# EAGLE schematic bluetooth_bma400 (EAGLE 9.6.2)
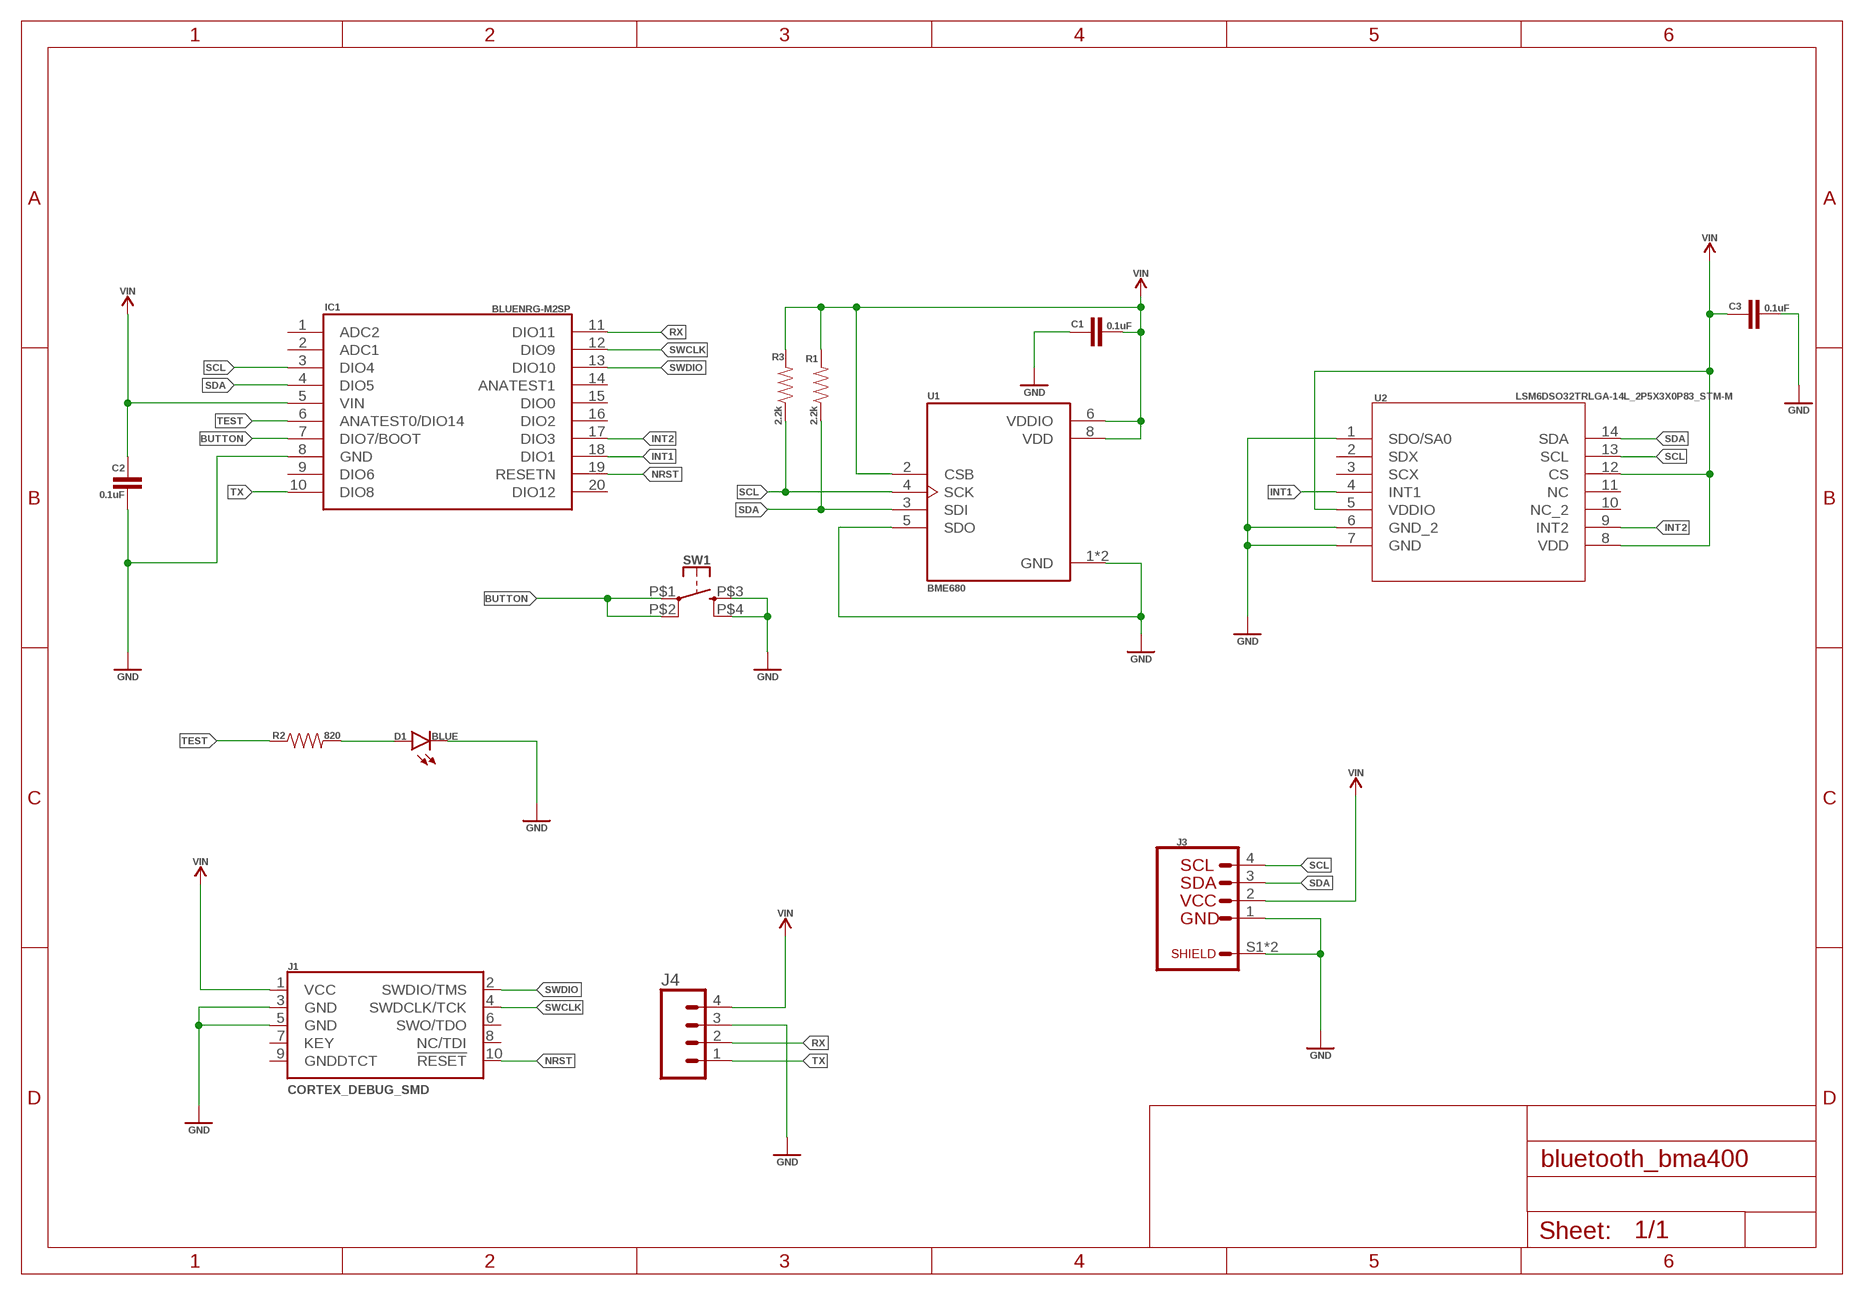
[diagram p0: schematic, sheet 1]

## Parts
C1  0.1uF  0.1UF-0603-25V-(+80/-20%)  [0603]
C2  0.1uF  0.1UF-0603-25V-(+80/-20%)  [0603]
C3  0.1uF  0.1UF-0603-25V-(+80/-20%)  [0603]
D1  BLUE  LED-BLUE0603  [LED-0603]
IC1  BLUENRG-M2SP  [BLUENRGM2SP]
J1  CORTEX_DEBUG_SMD  [SAMTECH_FTSH-105-01]
J3  QWIIC  [CONN_BM04B-SRSS-TB(LF)(SN)]
J4  CONN_04SMD  [1X04_SMD_RA_MALE]
R1  2.2k  2.2KOHM-0603-1/10W-1%  [0603]
R2  820  8.2KOHM-0603-1/10W-5%  [0603]
R3  2.2k  2.2KOHM-0603-1/10W-1%  [0603]
SW1  REVERSE_SWITCH  [REVERSE_TACTILE]
U1  BME680  [PSON80P300X300X100-8N]
U2  LSM6DSO32TRLGA-14L_2P5X3X0P83_STM-M  [LGA-14L_2P5X3X0P83_STM-M]

## Nets
BUTTON: IC1.7(DIO7/BOOT) SW1.P$1 SW1.P$2
GND: C1.1 C2.2 C3.2 D1.C IC1.8(GND) J1.3(GND) J1.5(GND) J3.1 J3.S1 J3.S2 J4.3(SDA) SW1.P$3 SW1.P$4 U1.1(GND) U1.5(SDO) U1.7(GND) U2.1(SDO/SA0) U2.6(GND_2) U2.7(GND)
INT1: IC1.18(DIO1) U2.4(INT1)
INT2: IC1.17(DIO3) U2.9(INT2)
N$1: D1.A R2.2
NRST: IC1.19(RESETN) J1.10(!RESET)
RX: IC1.11(DIO11) J4.2(SCL)
SCL: IC1.3(DIO4) J3.4 R3.1 U1.4(SCK) U2.13(SCL)
SDA: IC1.4(DIO5) J3.3 R1.1 U1.3(SDI) U2.14(SDA)
SWCLK: IC1.12(DIO9) J1.4(SWDCLK/TCK)
SWDIO: IC1.13(DIO10) J1.2(SWDIO/TMS)
TEST: IC1.6(ANATEST0/DIO14) R2.1
TX: IC1.10(DIO8) J4.1(VCC)
VIN: C1.2 C2.1 C3.1 IC1.5(VIN) J1.1(VCC) J3.2 J4.4(GND) R1.2 R3.2 U1.2(CSB) U1.6(VDDIO) U1.8(VDD) U2.5(VDDIO) U2.8(VDD) U2.12(CS)
Unconnected: IC1.1(ADC2) IC1.2(ADC1) IC1.9(DIO6) IC1.14(ANATEST1) IC1.15(DIO0) IC1.16(DIO2) IC1.20(DIO12) J1.6(SWO/TDO) J1.7(KEY) J1.8(NC/TDI) J1.9(GNDDTCT) U2.2(SDX) U2.3(SCX) U2.10(NC_2) U2.11(NC)

## Library data of the parts
C1-C3 = SparkFun-Capacitors:0.1UF: 0.1µF ceramic capacitors A capacitor is a passive two-terminal electrical component used to store electrical energy temporarily in an electric field.; PROD_ID: CAP-00810
D1 = SparkFun-LED:LED-BLUE: Blue SMD LED Used in manufacturing of various products at SparkFun Packages: 0603 - SMD 0603 package [Product Link] <http://www.digikey.com/product-detail/en/SMLE12BC7TT86/511-1589-2-ND/1641808> 1206 - SMD1206 package [Product Link] <http://www.digikey.com/product-detail/en/lite-on-inc/LTST-C150TBKT/160-1643-1-ND/573584> SparkFun Products: ESP8266 Thing-Dev Board <https://www.sparkfun.com/products/13711> RedBoard <https://www.sparkfun.com/products/12757>; PROD_ID: DIO-08575
IC1 = SamacSys_Parts:BLUENRG-M2SP: STMicroelectronics Source: Datasheet <https://www.st.com/resource/en/datasheet/bluenrg-m2.pdf>; ARROW_PART_NUMBER: BLUENRG-M2SP; ARROW_PRICE-STOCK: https://www.arrow.com/en/products/bluenrg-m2sp/stmicroelectronics; DESCRIPTION: STMicroelectronics; HEIGHT: 2.5mm; MANUFACTURER_NAME: STMicroelectronics; MANUFACTURER_PART_NUMBER: BLUENRG-M2SP; MOUSER_PART_NUMBER: 511-BLUENRG-M2SP; MOUSER_PRICE-STOCK: https://www.mouser.co.uk/ProductDetail/STMicroelectronics/BLUENRG-M2SP?qs=%252B6g0mu59x7IAMQd6TX9bOA%3D%3D
J1 = SparkFun-Connectors:CORTEX_DEBUG: Cortex Debug Connector - 10 pin Supports JTAG debug, Serial Wire debug, and Serial Wire Viewer. PTH and SMD connector options available. General Connector Information <http://infocenter.arm.com/help/topic/com.arm.doc.faqs/attached/13634/cortex_debug_connectors.pdf> Products: PTH Connector <http://www.digikey.com/product-detail/en/cnc-tech/3220-10-0100-00/1175-1627-ND/3883661> -via Digi-Key SparkFun PSoc <https://www.sparkfun.com/products/13229> SparkFun T <https://www.sparkfun.com/products/13810>
J3 = BM04B-SRSS-TB_LF__SN_:QWIIC
J4 = SparkFun-Connectors:CONN_04: Multi connection point. Often used as Generic Header-pin footprint for 0.1 inch spaced/style header connections On any of the 0.1 inch spaced packages, you can populate with these: Break Away Headers - Straight <https://www.sparkfun.com/products/116> (PRT-00116) Break Away Male Headers - Right Angle <https://www.sparkfun.com/products/553> (PRT-00553) Female Headers <https://www.sparkfun.com/products/115> (PRT-00115) Break Away Headers - Machine Pin <https://www.sparkfun.com/products/117> (PRT-00117) Break Away Female Headers - Swiss Machine Pin <https://www.sparkfun.com/products/743> (PRT-00743) For SCREWTERMINALS and SPRING TERMINALS visit here: Screw Terimnals on SparkFun.com <https://www.sparkfun.com/search/results?term=Screw+Terminals> (5mm/3.5mm/2.54mm spacing) This device is also useful as a general connection point to wire up your design to another part of your project. Our various solder wires solder well into these plated through hole pads. Hook-Up Wire - Assortment (Stranded, 22 AWG) <https://www.sparkfun.com/products/11375> (PRT-11375) Hook-Up Wire - Assortment (Solid Core, 22 AWG) <https://www.sparkfun.com/products/11367> (PRT-11367) View the entire wire category on our website here <https://www.sparkfun.com/categories/141> Special notes: Molex polarized connector foot print use with SKU : PRT-08231 with associated crimp pins and housings. 1MM SMD Version SKU: PRT-10208; PROD_ID: CONN-09140; SF_ID: PRT-12638
R1 R3 = SparkFun-Resistors:2.2KOHM: 2.2kΩ resistor A resistor is a passive two-terminal electrical component that implements electrical resistance as a circuit element. Resistors act to reduce current flow, and, at the same time, act to lower voltage levels within circuits. - Wikipedia; PROD_ID: RES-08272
R2 = SparkFun-Resistors:8.2KOHM: 8.2kΩ resistor A resistor is a passive two-terminal electrical component that implements electrical resistance as a circuit element. Resistors act to reduce current flow, and, at the same time, act to lower voltage levels within circuits. - Wikipedia; PROD_ID: RES-10646; SPICEPREFIX: R; VALUE: 8.2k
SW1 = reverse_mount_sw:REVERSE_SWITCH
U1 = BME680:BME680: Integrated Environmental Unit Check availability <https://pricing.snapeda.com/parts/BME680/Bosch%20Sensortec/view-part?ref=eda>; AVAILABILITY: In Stock; DESCRIPTION: Gas, Humidity, Pressure, Temperature Sensor I²C, SPI Output; MF: Bosch Sensortec; MP: BME680; PACKAGE: LGA-8 Bosch Tools; PRICE: None; PURCHASE-URL: https://pricing.snapeda.com/search/part/BME680/?ref=eda
U2 = LSM6DSO32:LSM6DSO32TR; COPYRIGHT: Copyright (C) 2022 Ultra Librarian. All rights reserved.; MANUFACTURER_PART_NUMBER: LSM6DSO32TR; MFR_NAME: STMicroelectronics